# EAGLE design CMP2 (EAGLE 9.6.2)
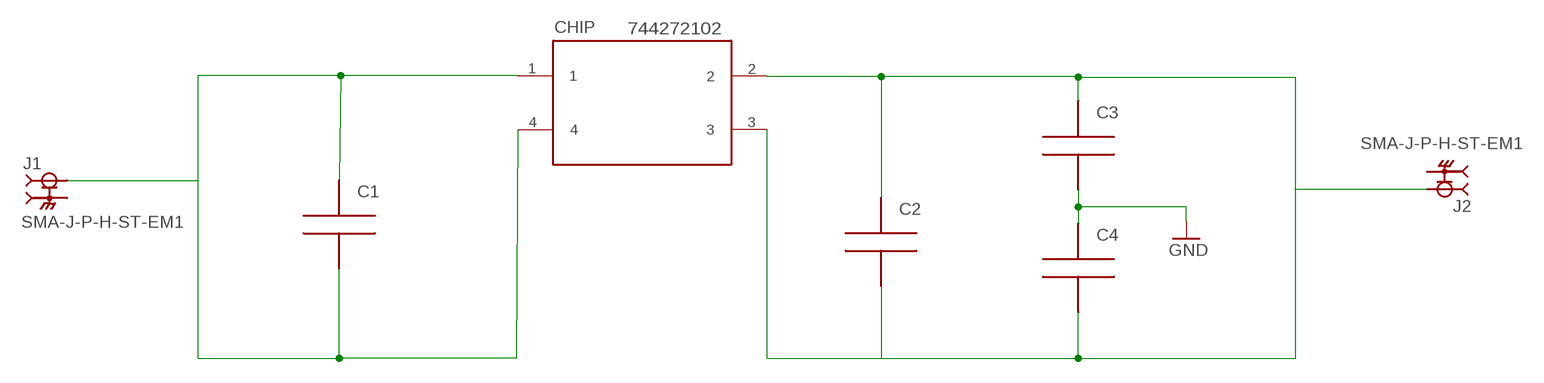
[diagram p0: schematic, sheet 1]

## Parts
C1  CAPA1206  [FGJGFN]
C2  CAPA1206  [FGJGFN]
C3  CAPA1206  [FGJGFN]
C4  CAPA1206  [FGJGFN]
CHIP  CHOKE  [CHOKE]
J1  SMA-J-P-H-ST-EM1  [SAMTEC_SMA-J-P-H-ST-EM1]
J2  SMA-J-P-H-ST-EM1  [SAMTEC_SMA-J-P-H-ST-EM1]

## Nets
GND: C3.1 C4.2
N$3: C1.1 C1.2 CHIP.1 CHIP.4 J1.1
N$4: C2.1 C2.2 C3.2 C4.1 CHIP.2 CHIP.3 J2.1
Unconnected: J1.2_1 J1.2_2 J1.3_1 J1.3_2 J2.2_1 J2.2_2 J2.3_1 J2.3_2

## Notes on the sheet
- C1=1500pF

## Library data of the parts
C1-C4 = capa:CAPA
CHIP = CHOKE:CHOKE
J1 J2 = SMA:SMA-J-P-H-ST-EM1: SMA Connector Jack, Female Socket 50Ohm Board Edge, End Launch Solder; MANUFACTURER: Samtec; MAXIMUM_PACKAGE_HEIGHT: 3.675mm; PARTREV: G; STANDARD: Manufacturer Recommendations

## Board
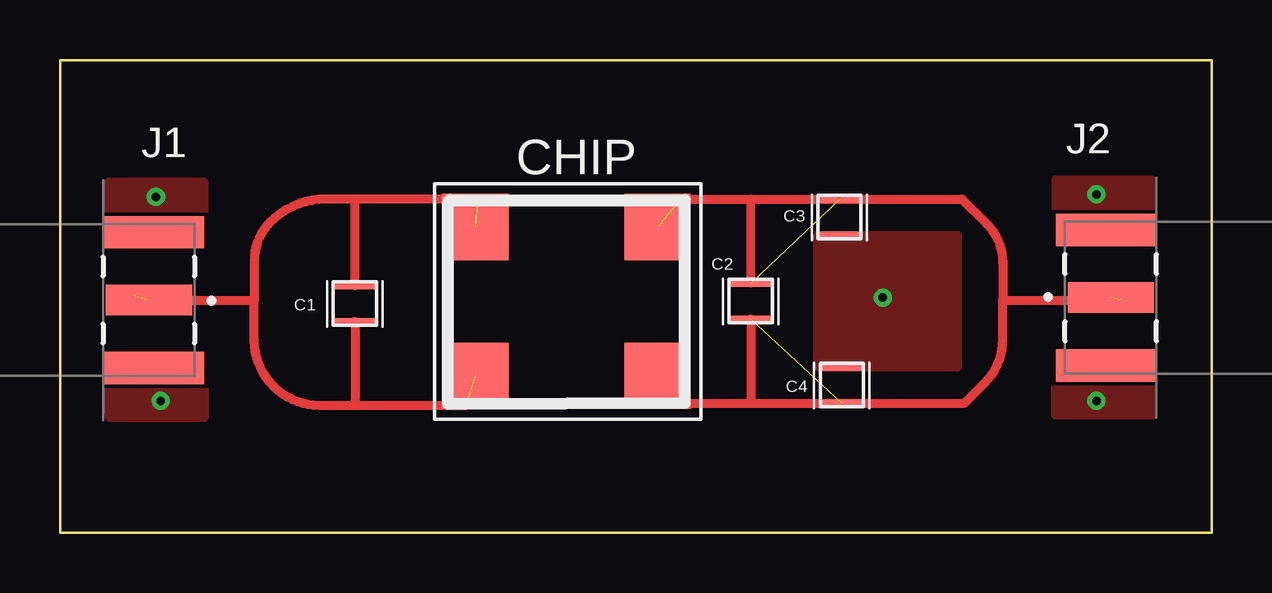
[diagram p1: board, top side]
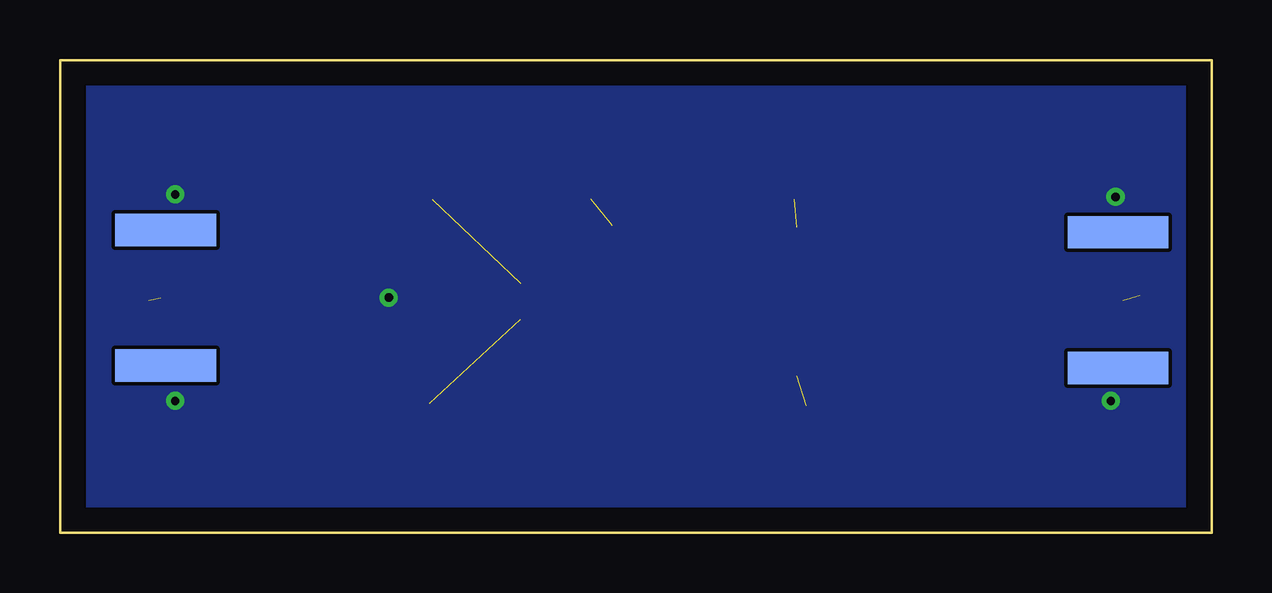
[diagram p2: board, bottom side, seen from below]

Size 48 x 19.7 mm. Coordinates in mm from the lower left corner, seen from the top.
Outline: 0,19.7 48,19.7 48,0 0,0 0,19.7
Copper layers (1*16): Top 0.035mm / dielectric 1.5mm / Bottom 0.035mm
Design rules "default": minimum track width 6mil, minimum drill 0.35mm, track to track 6mil, track to pad 6mil, pad to pad 6mil, via to via 6mil, smd to smd 6mil, copper to edge 40mil, drill to drill 6mil, minimum pad ring 10mil, minimum via ring 8mil, stop-mask expansion 4mil, vias tented up to drill 0mil, thermal gap 10mil

### Footprints (pad centres in the part's own frame; a part is rotated, then mirrored left to right if it is on the bottom)
FGJGFN = smd 0.3 x 1.8: 1 -0.8,0; 2 0.7,0
CHOKE = smd 2.76 x 2.76: 1 -3.79,2.54; 2 3.81,2.54; 3 3.81,-3.66; 4 -3.79,-3.66
SAMTEC_SMA-J-P-H-ST-EM1 = smd 1.27 x 3.6: 1 0,0 | smd 1.35 x 4.2: 2_1 -2.825,0.2; 3_1 2.825,0.2 | smd 1.35 x 4.2 bottom: 2_2 -2.825,0.2; 3_2 2.825,0.2

### Placement (x,y rotation side)
C1  12.3,9.6 90 top
C2  28.8,9.7 90 top
C3  32.5,13.2 90 top
C4  32.6,6.2 90 top
CHIP  21.1,10.2 0 top
J1  3.7,9.7 270 top
J2  43.8,9.8 90 top

### Tracks (layer width: path | path; a pad name or v marks a point on that pad's centre or on a via)
GND  (via drill 0.35)
  other vias: 34.3,9.8 4,14 4.2,5.5 43.2,14.1 43.2,5.5
  pour Top (no thermals): 31.6,12.4 37.4,12.4 37.4,6.9 31.6,6.9
  pour Top (no thermals): 45.5,14.7 41.5,14.7 41.5,12 45.5,12
  pour Top (no thermals): 41.5,7.6 45.5,7.6 45.5,4.9 41.5,4.9
  pour Top (no thermals): 6,14.6 2,14.6 2,11.9 6,11.9
  pour Top (no thermals): 1.92,7.5 6,7.5 6,4.8 2.08,4.8
  pour Bottom: 0,19.7 48,19.7 48,19.5 48,0.1 47.9,0.1 0,0.1
N$3  (3 unrouted)
  Top 0.38: 16.9,5.3 12.3,5.3 | 17.4,13.9 12.3,13.9 | C1.2 12.3,13.9 | C1.1 12.3,5.3 | 8.1,9.67 3.23,9.67 3,9.9 | 12.3,13.9 11.08,13.9 arc45 8.76,12.94 arc45 8.1,11.35 8.1,9.67 | 12.3,5.3 10.83,5.3 arc-45 8.9,6.1 arc-45 8.1,8.03 8.1,9.67
N$4  (4 unrouted)
  Top 0.38: 25.87,13.9 28.8,13.9 | 28.8,13.9 37.6,13.9 38.63,12.87 arc-45 39.3,11.25 39.3,9.7 | CHIP.3 26.05,5.4 28.8,5.4 | 28.8,5.4 37.7,5.4 38.56,6.26 arc45 39.3,8.05 39.3,9.7 | C2.2 28.8,13.9 | C2.1 28.8,5.4 | 39.3,9.7 44.3,9.7
  Top 0.508: CHIP.2 24.97,12.8